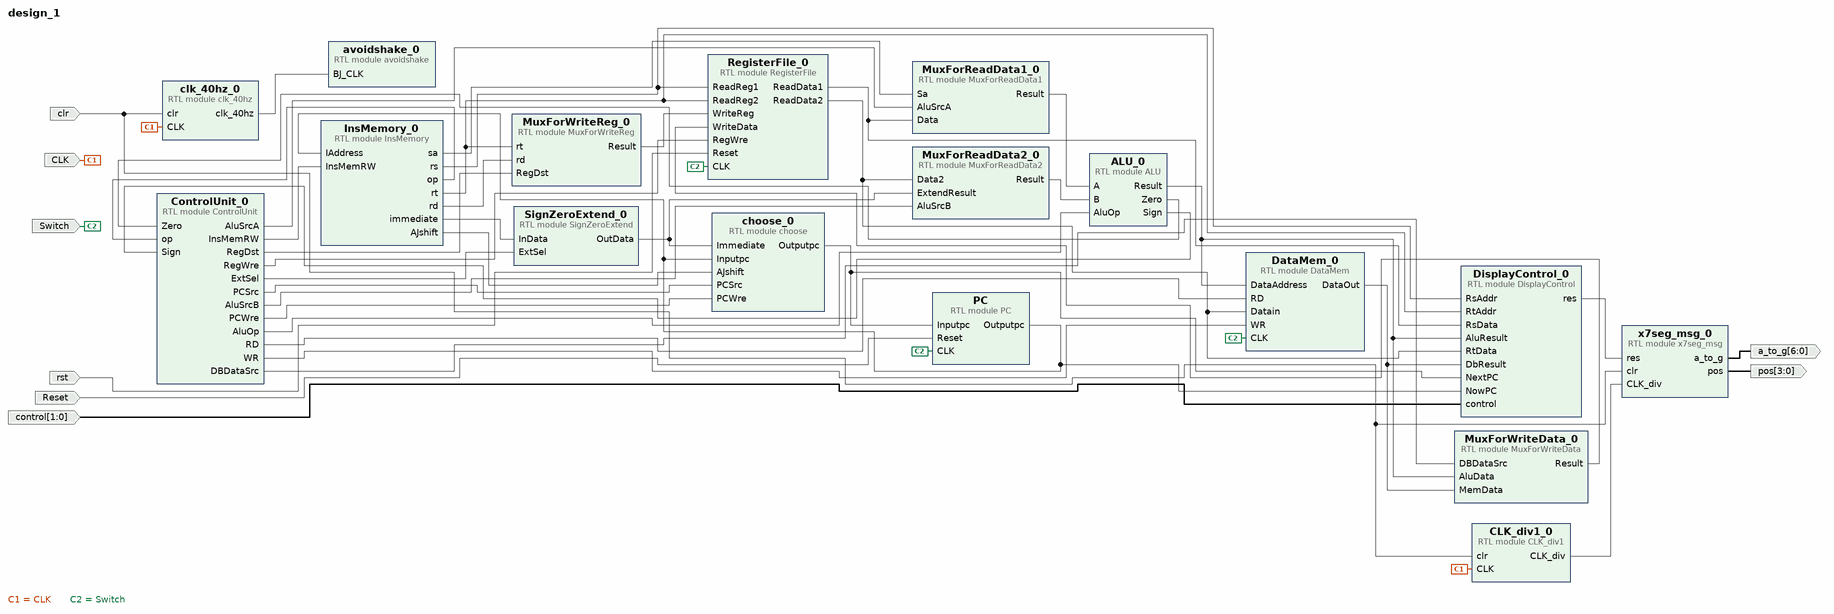
[diagram p0: block diagram of the top level]
# Vivado block design design_1, xc7a35tcpg236-1, Vivado 2016.4
create_bd_design design_1

create_bd_port -dir I Reset
create_bd_port -dir I -from 1 -to 0 control
create_bd_port -dir I -type clk CLK
set_property -dict {CONFIG.FREQ_HZ 100000000} [get_bd_ports CLK]
create_bd_port -dir I clr
create_bd_port -dir O -from 6 -to 0 a_to_g
create_bd_port -dir O -from 3 -to 0 pos
create_bd_port -dir I rst
create_bd_port -dir I Switch

create_bd_cell -type module -reference ALU ALU_0
create_bd_cell -type module -reference MuxForWriteReg MuxForWriteReg_0
create_bd_cell -type module -reference MuxForReadData1 MuxForReadData1_0
create_bd_cell -type module -reference MuxForReadData2 MuxForReadData2_0
create_bd_cell -type module -reference SignZeroExtend SignZeroExtend_0
create_bd_cell -type module -reference MuxForWriteData MuxForWriteData_0
create_bd_cell -type module -reference ControlUnit ControlUnit_0
create_bd_cell -type module -reference DataMem DataMem_0
create_bd_cell -type module -reference InsMemory InsMemory_0
create_bd_cell -type module -reference x7seg_msg x7seg_msg_0
create_bd_cell -type module -reference CLK_div1 CLK_div1_0
create_bd_cell -type module -reference DisplayControl DisplayControl_0
create_bd_cell -type module -reference PC PC
create_bd_cell -type module -reference clk_40hz clk_40hz_0
create_bd_cell -type module -reference avoidshake avoidshake_0
create_bd_cell -type module -reference RegisterFile RegisterFile_0
create_bd_cell -type module -reference choose choose_0

# ---- connections ----

connect_bd_net [get_bd_pins InsMemory_0/op] [get_bd_pins ControlUnit_0/op]
connect_bd_net [get_bd_pins ControlUnit_0/InsMemRW] [get_bd_pins InsMemory_0/InsMemRW]
connect_bd_net [get_bd_pins ControlUnit_0/PCSrc] [get_bd_pins choose_0/PCSrc]
connect_bd_net [get_bd_pins InsMemory_0/rs] [get_bd_pins DisplayControl_0/RsAddr] [get_bd_pins RegisterFile_0/ReadReg1]
connect_bd_net [get_bd_pins InsMemory_0/rt] \
  [get_bd_pins MuxForWriteReg_0/rt] [get_bd_pins DisplayControl_0/RtAddr] [get_bd_pins RegisterFile_0/ReadReg2]
connect_bd_net [get_bd_pins ControlUnit_0/PCWre] [get_bd_pins choose_0/PCWre]
connect_bd_net [get_bd_pins ControlUnit_0/ExtSel] [get_bd_pins SignZeroExtend_0/ExtSel]
connect_bd_net [get_bd_pins ControlUnit_0/AluSrcA] [get_bd_pins MuxForReadData1_0/AluSrcA]
connect_bd_net [get_bd_pins ControlUnit_0/AluSrcB] [get_bd_pins MuxForReadData2_0/AluSrcB]
connect_bd_net [get_bd_pins RegisterFile_0/ReadData2] \
  [get_bd_pins MuxForReadData2_0/Data2] [get_bd_pins DataMem_0/Datain] [get_bd_pins DisplayControl_0/RtData]
connect_bd_net [get_bd_pins InsMemory_0/sa] [get_bd_pins MuxForReadData1_0/Sa]
connect_bd_net [get_bd_pins RegisterFile_0/ReadData1] [get_bd_pins MuxForReadData1_0/Data] [get_bd_pins DisplayControl_0/RsData]
connect_bd_net [get_bd_pins MuxForReadData1_0/Result] [get_bd_pins ALU_0/A]
connect_bd_net [get_bd_pins MuxForReadData2_0/Result] [get_bd_pins ALU_0/B]
connect_bd_net [get_bd_pins ControlUnit_0/AluOp] [get_bd_pins ALU_0/AluOp]
connect_bd_net [get_bd_pins ControlUnit_0/RegWre] [get_bd_pins RegisterFile_0/RegWre]
connect_bd_net [get_bd_pins ALU_0/Result] \
  [get_bd_pins MuxForWriteData_0/AluData] [get_bd_pins DataMem_0/DataAddress] [get_bd_pins DisplayControl_0/AluResult]
connect_bd_net [get_bd_pins ControlUnit_0/RD] [get_bd_pins DataMem_0/RD]
connect_bd_net [get_bd_pins ControlUnit_0/WR] [get_bd_pins DataMem_0/WR]
connect_bd_net [get_bd_pins ALU_0/Zero] [get_bd_pins ControlUnit_0/Zero]
connect_bd_net [get_bd_pins ALU_0/Sign] [get_bd_pins ControlUnit_0/Sign]
connect_bd_net [get_bd_pins DataMem_0/DataOut] [get_bd_pins MuxForWriteData_0/MemData] [get_bd_pins DisplayControl_0/DbResult]
connect_bd_net [get_bd_pins ControlUnit_0/DBDataSrc] [get_bd_pins MuxForWriteData_0/DBDataSrc]
connect_bd_net [get_bd_pins MuxForWriteData_0/Result] [get_bd_pins RegisterFile_0/WriteData]
connect_bd_net [get_bd_pins InsMemory_0/AJshift] [get_bd_pins choose_0/AJshift]
connect_bd_net [get_bd_pins InsMemory_0/rd] [get_bd_pins MuxForWriteReg_0/rd]
connect_bd_net [get_bd_pins ControlUnit_0/RegDst] [get_bd_pins MuxForWriteReg_0/RegDst]
connect_bd_net [get_bd_pins MuxForWriteReg_0/Result] [get_bd_pins RegisterFile_0/WriteReg]
connect_bd_net [get_bd_ports Reset] [get_bd_pins PC/Reset]
connect_bd_net [get_bd_pins SignZeroExtend_0/OutData] [get_bd_pins MuxForReadData2_0/ExtendResult] [get_bd_pins choose_0/Immediate]
connect_bd_net [get_bd_pins InsMemory_0/immediate] [get_bd_pins SignZeroExtend_0/InData]
connect_bd_net [get_bd_ports control] [get_bd_pins DisplayControl_0/control]
connect_bd_net [get_bd_ports CLK] [get_bd_pins CLK_div1_0/CLK] [get_bd_pins clk_40hz_0/CLK]
connect_bd_net [get_bd_ports clr] [get_bd_pins x7seg_msg_0/clr] [get_bd_pins CLK_div1_0/clr] [get_bd_pins clk_40hz_0/clr]
connect_bd_net -net CLK_div1_0_CLK_1k [get_bd_pins CLK_div1_0/CLK_div] [get_bd_pins x7seg_msg_0/CLK_div]
connect_bd_net [get_bd_pins DisplayControl_0/res] [get_bd_pins x7seg_msg_0/res]
connect_bd_net [get_bd_pins x7seg_msg_0/a_to_g] [get_bd_ports a_to_g]
connect_bd_net [get_bd_pins x7seg_msg_0/pos] [get_bd_ports pos]
connect_bd_net [get_bd_ports rst] [get_bd_pins RegisterFile_0/Reset]
connect_bd_net [get_bd_pins PC/Outputpc] [get_bd_pins InsMemory_0/IAddress] [get_bd_pins DisplayControl_0/NowPC] [get_bd_pins choose_0/Inputpc]
connect_bd_net [get_bd_pins choose_0/Outputpc] [get_bd_pins PC/Inputpc] [get_bd_pins DisplayControl_0/NextPC]
connect_bd_net [get_bd_pins clk_40hz_0/clk_40hz] [get_bd_pins avoidshake_0/BJ_CLK]
connect_bd_net [get_bd_ports Switch] [get_bd_pins DataMem_0/CLK] [get_bd_pins PC/CLK] [get_bd_pins RegisterFile_0/CLK]

validate_bd_design
save_bd_design
